# Altium schematic sheet VL53L1X.SchDoc
size A4; DocumentNumber: 2; SheetNumber: 2; SheetTotal: 6; sheetTitle: VL53L1X Sensor
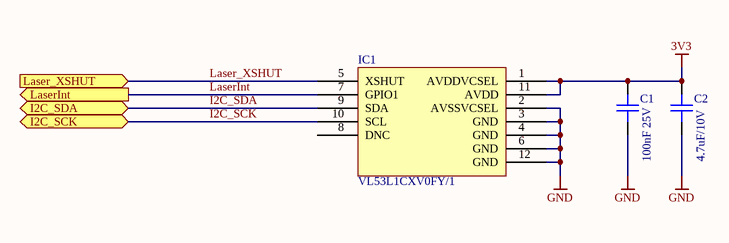
[diagram p0: VL53L1X.SchDoc]

## Parts
C1  value 100nF 25V  [C0402]  (hidden comment: UniversalCapacitor)
C2  4.7uF/10V  [C0402_big]
IC1  value VL53L1CXV0FY/1  [VL53L1X]  (hidden comment: VL53L1X)

## Ports
I2C_SCK (bidir), I2C_SDA (bidir), Laser_XSHUT (in), LaserInt (out)

## Nets
3V3: C1.2 C2.1 IC1.1(AVDDVCSEL) IC1.11(AVDD)
GND: C1.1 C2.2 IC1.2(AVSSVCSEL) IC1.3(GND) IC1.4(GND) IC1.6(GND) IC1.12(GND)
I2C_SCK: IC1.10(SCL) ; port I2C_SCK
I2C_SDA: IC1.9(SDA) ; port I2C_SDA
Laser_XSHUT: IC1.5(XSHUT) ; port Laser_XSHUT
LaserInt: IC1.7(GPIO1) ; port LaserInt

Not connected (* = marked no-connect by the designer): IC1 8(DNC)

## Notes on the sheet
- Title:
- Size:
- Date:
- A4
- Number:
- Time:
- Revision:
- Sheet
- of
- Autor:
- Project:
- File:

## Library data of the parts
C1 = 0402B104K250CT: WALSIN - 0402B104K250CT - CAPACITOR, MLCC, X7R, 0.1UF, 25V, 0402; part_id: 2099; name: 0402B104K250CT; Supplier 1: Farnell; Supplier Part Number 1: 2496772; ComponentLink1URL: http://cz.farnell.com/2496772?Ntt=2496772; HelpURL: http://www.farnell.com/datasheets/2340522.pdf; footprint_name: C0402; schematic_name: UniversalCapacitor
C2 = GRM155R61A475MEAAD: MURATA - GRM155R61A475MEAAD - CAP, MLCC, X5R, 4.7UF, 10V, 0402; part_id: 2175; Value: 4.7uF/10V; name: GRM155R61A475MEAAD; Supplier 1: Farnell; Supplier Part Number 1: 2688503; ComponentLink1URL: http://cz.farnell.com/2688503?Ntt=2688503; HelpURL: http://www.farnell.com/datasheets/2189109.pdf; footprint_name: C0402_big; schematic_name: UniversalCapacitor
IC1 = VL53L1CXV0FY/1: STMICROELECTRONICS - VL53L1CXV0FY/1 - Proximity Sensor, I2C, 4000 mm, OLGA, 12 Pins, 2.6 V, 3.5 V; part_id: 2672; name: VL53L1CXV0FY/1; Supplier 1: Farnell; Supplier Part Number 1: 2851946; ComponentLink1URL: http://cz.farnell.com/2851946?Ntt=2851946; HelpURL: http://www.farnell.com/datasheets/2600105.pdf; footprint_name: VL53L1X; schematic_name: VL53L1X